# EAGLE design Qwiic_Shield_for_Teensy_Long (EAGLE 9.6.2)
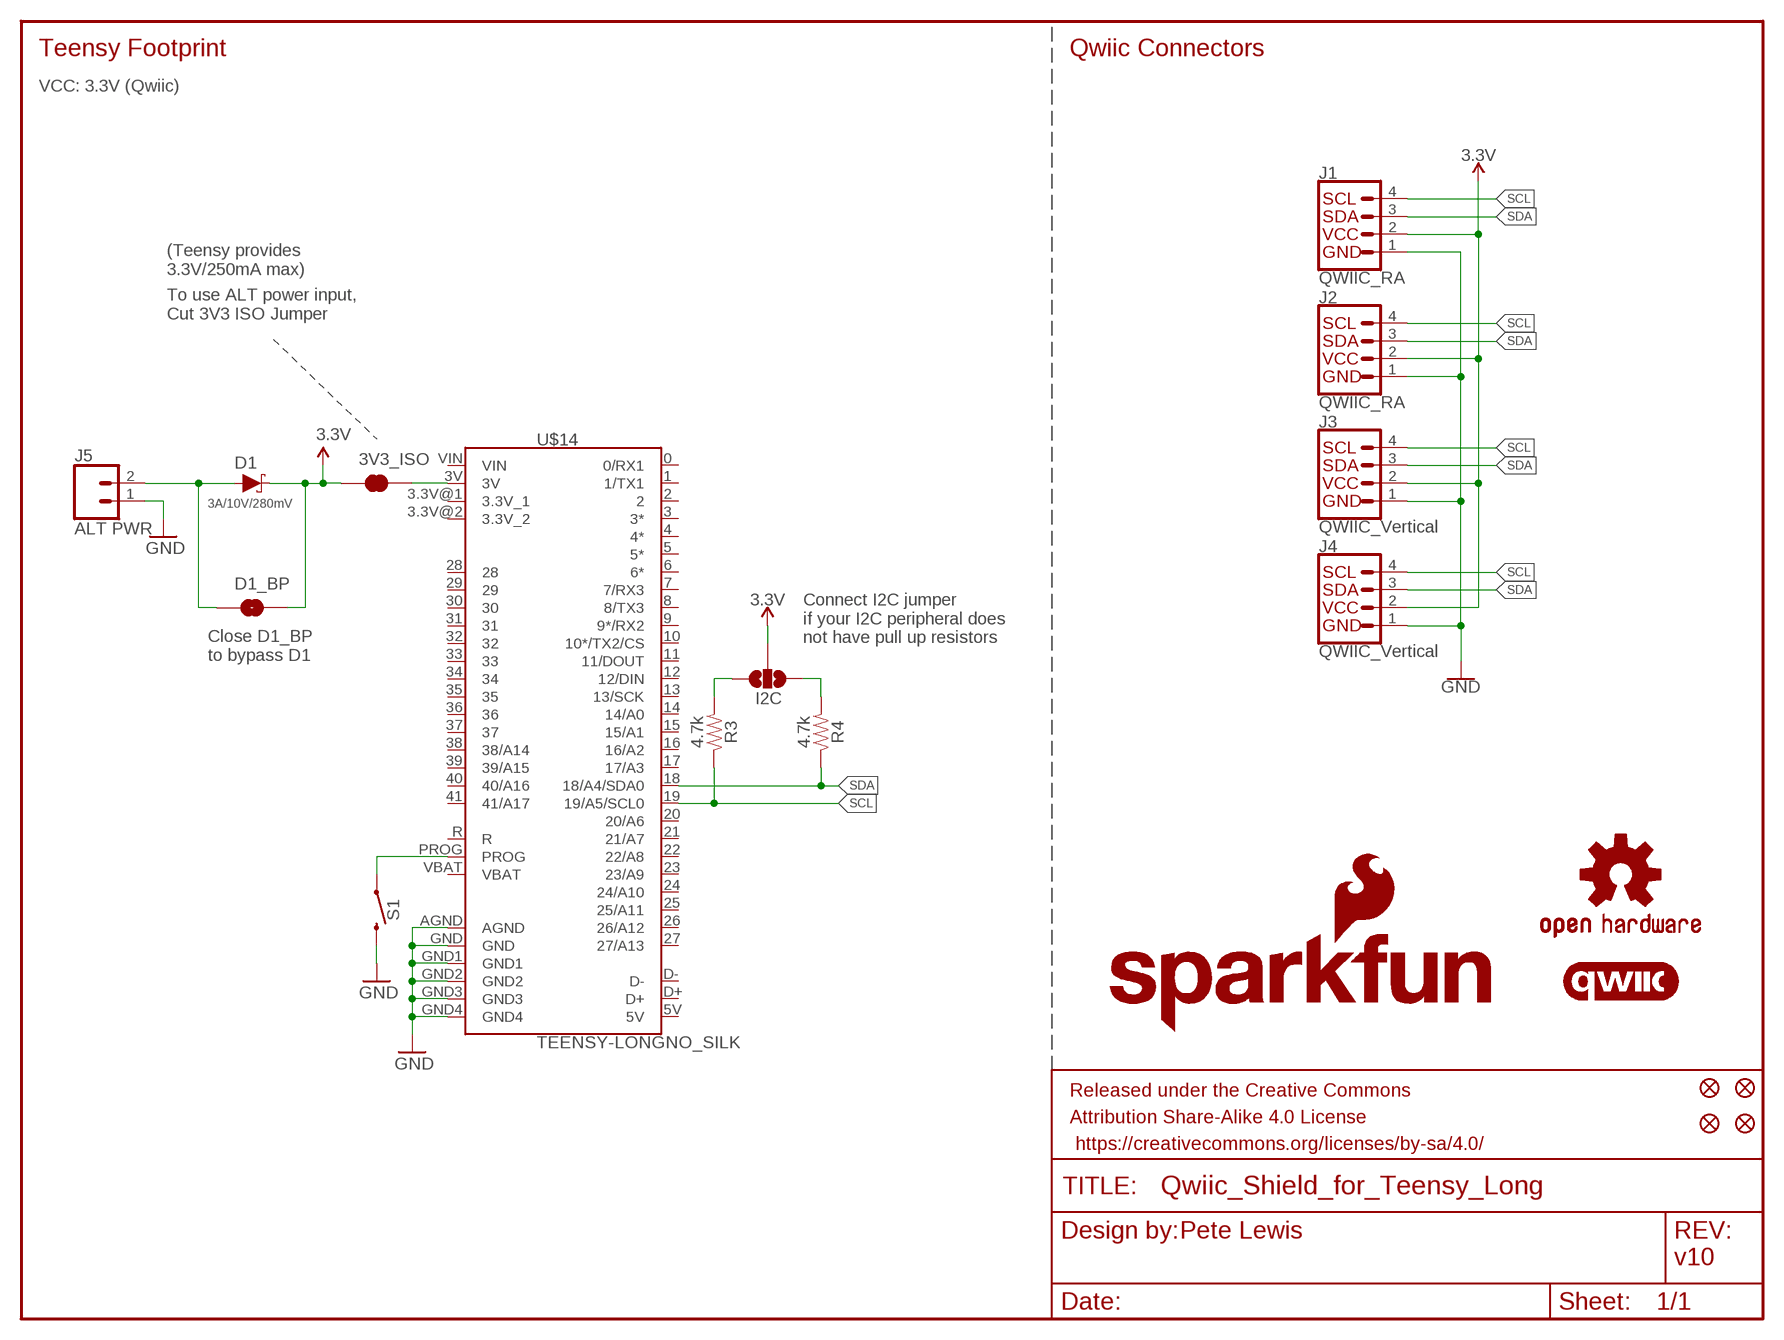
[diagram p0: schematic, sheet 1]

## Parts
3V3_ISO  JUMPER-SMT_2_NC_TRACE_SILK  [SMT-JUMPER_2_NC_TRACE_SILK]
D1  3A/10V/280mV  DIODE-SCHOTTKY-BAT60A  [SOD-323]
D1_BP  JUMPER-SMT_2_NO_SILK  [SMT-JUMPER_2_NO_SILK]
FD1  FIDUCIAL1X2  [FIDUCIAL-1X2]
FD2  FIDUCIAL1X2  [FIDUCIAL-1X2]
FD3  FIDUCIAL1X2  [FIDUCIAL-1X2]
FD4  FIDUCIAL1X2  [FIDUCIAL-1X2]
FRAME1  FRAME-LETTER  [CREATIVE_COMMONS]
I2C  JUMPER-SMT_3_NO_SILK  [SMT-JUMPER_3_NO_SILK]
J1  QWIIC_RA  QWIIC_CONNECTORJS-1MM  [JST04_1MM_RA]
J2  QWIIC_RA  QWIIC_CONNECTORJS-1MM  [JST04_1MM_RA]
J3  QWIIC_Vertical  QWIIC_CONNECTOR  [JST04_1MM_VERT]
J4  QWIIC_Vertical  QWIIC_CONNECTOR  [JST04_1MM_VERT]
J5  ALT PWR  CONN_021X02_NO_SILK  [1X02_NO_SILK]
LOGO1  SFE_LOGO_NAME_FLAME.1_INCH  [SFE_LOGO_NAME_FLAME_.1]
LOGO2  SFE_LOGO_NAME_FLAME.1_INCH  [SFE_LOGO_NAME_FLAME_.1]
LOGO3  OSHW-LOGOS  [OSHW-LOGO-S]
LOGO4  QWIIC_LOGO_5MM  [QWIIC_5MM]
LOGO5  QWIIC_LOGO_5MM  [QWIIC_5MM]
R3  4.7k  4.7KOHM-0603-1/10W-1%  [0603]
R4  4.7k  4.7KOHM-0603-1/10W-1%  [0603]
S1  MOMENTARY-SWITCH-SPST-SMD-5.2MM-TALL  [TACTILE_SWITCH_SMD_5.2MM]
U$14  TEENSY-LONGNO_SILK  [TEENSY-LONG_NO_SILK]

## Nets
3.3V: 3V3_ISO.1 D1.C D1_BP.2 I2C.2 J1.2 J2.2 J3.2 J4.2
GND: J1.1 J2.1 J3.1 J4.1 J5.1 S1.3 U$14.AGND U$14.GND U$14.GND1 U$14.GND2 U$14.GND3 U$14.GND4
N$1: I2C.3 R4.2
N$2: I2C.1 R3.2
N$3: 3V3_ISO.2 U$14.3V
N$4: D1.A D1_BP.1 J5.2
N$5: S1.1 U$14.PROG
SCL: J1.4 J2.4 J3.4 J4.4 R3.1 U$14.19(19/A5/SCL0)
SDA: J1.3 J2.3 J3.3 J4.3 R4.1 U$14.18(18/A4/SDA0)
Unconnected: U$14.0(0/RX1) U$14.1(1/TX1) U$14.2 U$14.3(3*) U$14.4(4*) U$14.5(5*) U$14.6(6*) U$14.7(7/RX3) U$14.8(8/TX3) U$14.9(9*/RX2) U$14.10(10*/TX2/CS) U$14.11(11/DOUT) U$14.12(12/DIN) U$14.13(13/SCK) U$14.14(14/A0) U$14.15(15/A1) U$14.16(16/A2) U$14.17(17/A3) U$14.20(20/A6) U$14.21(21/A7) U$14.22(22/A8) U$14.23(23/A9) U$14.24(24/A10) U$14.25(25/A11) U$14.26(26/A12) U$14.27(27/A13) U$14.28 U$14.29 U$14.30 U$14.31 U$14.32 U$14.33 U$14.34 U$14.35 U$14.36 U$14.37 U$14.38(38/A14) U$14.39(39/A15) U$14.40(40/A16) U$14.41(41/A17) U$14.R

## Notes on the sheet
- Teensy Footprint | Qwiic Connectors
- VCC: 3.3V (Qwiic)
- (Teensy provides 
  3.3V/250mA max)
- To use ALT power input,
  Cut 3V3 ISO Jumper
- Connect I2C jumper 
  if your I2C peripheral does 
  not have pull up resistors
- Close D1_BP
  to bypass D1
- Pete Lewis
- v10

## Power pins joined to a net without a drawn wire
3.3V_1: U$14.3.3V@1(3.3V_1)
3.3V_2: U$14.3.3V@2(3.3V_2)
5V: U$14.5V
D+: U$14.D+
D-: U$14.D-
VBAT: U$14.VBAT
VIN: U$14.VIN

## Library data of the parts
3V3_ISO = SparkFun-Jumpers:JUMPER-SMT_2_NC_TRACE: Normally closed trace jumper This jumper has a trace between two pads so it's normally closed (NC). Use a razor knife to open the connection. For best results follow the IPC guidelines for cutting traces: Cutout at least 0.063 mm (0.005 in). Remove all loose material to clean up the cut area. Seal the cut with an approved epoxy. Reapply solder to reclose the connection.
D1 = SparkFun-DiscreteSemi:DIODE-SCHOTTKY: Schottky diode A Schottky diode is a semiconductor diode which has a low forward voltage drop and a very fast switching action.; PROD_ID: DIO-14072
D1_BP = SparkFun-Jumpers:JUMPER-SMT_2_NO: Normally open jumper This jumper has two pads in close proximity to each other. Apply solder to close the connection. Round pads are easier to solder for beginners, but are a lot larger. SparkFun Product that uses the round pads: SparkFun EL Sequencer <https://www.sparkfun.com/products/12781>
FD1-FD4 = SparkFun-Aesthetics:FIDUCIAL: Fiducial Alignment Points Point-of-reference for pick-and-place machines and other optical instruments.
FRAME1 = SparkFun-Aesthetics:FRAME-LETTER: Schematic Frame - Letter Standard 8.5x11 US Letter frame
I2C = SparkFun-Jumpers:JUMPER-SMT_3_NO: Normally open jumper This jumper has three pads in close proximity to each other. Apply solder to close the connection(s).
J1 J2 = SparkFun-Connectors:QWIIC_CONNECTOR: SparkFun I2C Standard Qwiic Connector An SMD 1mm pitch JST connector makes it easy and quick (get it? Qwiic?) to connect I2C devices to each other. The Qwiic system <http://www.sparkfun.com/qwiic> enables fast and solderless connection between popular platforms and various sensors and actuators. We carry 200mm <https://www.sparkfun.com/products/14204>, 100mm <https://www.sparkfun.com/products/14205>, 50mm <https://www.sparkfun.com/products/14206>, and breadboard friendly <https://www.sparkfun.com/products/14207> Qwiic cables. We also offer 10 pcs strips <https://www.sparkfun.com/products/14323> the SMD connectors.; PROD_ID: CONN-13694; VALUE: QWIIC_RIGHT_ANGLE
J3 J4 = SparkFun-Connectors:QWIIC_CONNECTOR: SparkFun I2C Standard Qwiic Connector An SMD 1mm pitch JST connector makes it easy and quick (get it? Qwiic?) to connect I2C devices to each other. The Qwiic system <http://www.sparkfun.com/qwiic> enables fast and solderless connection between popular platforms and various sensors and actuators. We carry 200mm <https://www.sparkfun.com/products/14204>, 100mm <https://www.sparkfun.com/products/14205>, 50mm <https://www.sparkfun.com/products/14206>, and breadboard friendly <https://www.sparkfun.com/products/14207> Qwiic cables. We also offer 10 pcs strips <https://www.sparkfun.com/products/14323> the SMD connectors.; PROD_ID: CONN-14483; VALUE: Vertical Qwiic Connector
J5 = SparkFun-Connectors:CONN_02: Multi connection point. Often used as Generic Header-pin footprint for 0.1 inch spaced/style header connections On any of the 0.1 inch spaced packages, you can populate with these: Break Away Headers - Straight <https://www.sparkfun.com/products/116> (PRT-00116) Break Away Male Headers - Right Angle <https://www.sparkfun.com/products/553> (PRT-00553) Female Headers <https://www.sparkfun.com/products/115> (PRT-00115) Break Away Headers - Machine Pin <https://www.sparkfun.com/products/117> (PRT-00117) Break Away Female Headers - Swiss Machine Pin <https://www.sparkfun.com/products/743> (PRT-00743) For SCREWTERMINALS and SPRING TERMINALS visit here: Screw Terimnals on SparkFun.com <https://www.sparkfun.com/search/results?term=Screw+Terminals> (5mm/3.5mm/2.54mm spacing) This device is also useful as a general connection point to wire up your design to another part of your project. Our various solder wires solder well into these plated through hole pads. Hook-Up Wire - Assortment (Stranded, 22 AWG) <https://www.sparkfun.com/products/11375> (PRT-11375) Hook-Up Wire - Assortment (Solid Core, 22 AWG) <https://www.sparkfun.com/products/11367> (PRT-11367) View the entire wire category on our website here <https://www.sparkfun.com/categories/141> Special notes: Molex polarized connector foot print use with: PRT-08233 with associated crimp pins and housings. 2.54_SCREWTERM for use with PRT-10571. 3.5mm Screw Terminal footprints for PRT-08084 5mm Screw Terminal footprints for use with PRT-08432
LOGO1 LOGO2 = SparkFun-Aesthetics:SFE_LOGO_NAME_FLAME: SparkFun Font Logo w/ Flame This is the SparkFun full logo. The logo on the schematic will always be the same size; the package variant is the height of the flame part of the logo. Default layer for the logo on the board is tSilk.
LOGO3 = SparkFun-Aesthetics:OSHW-LOGO: Open-Source Hardware (OSHW) Logo This logo indicates the piece of hardware it is found on incorporates a OSHW license and/or adheres to the definition of open source hardware found here: http://freedomdefined.org/OSHW
LOGO4 LOGO5 = SparkFun-Aesthetics:QWIIC_LOGO: Qwiic Logos for placement on schematic and PCB. The 5.5mm silk logo is best for placing next to Qwiic connector.
R3 R4 = SparkFun-Resistors:4.7KOHM: 4.7kΩ resistor A resistor is a passive two-terminal electrical component that implements electrical resistance as a circuit element. Resistors act to reduce current flow, and, at the same time, act to lower voltage levels within circuits. - Wikipedia; PROD_ID: RES-07857
S1 = SparkFun-Switches:MOMENTARY-SWITCH-SPST: Momentary Switch (Pushbutton) - SPST Normally-open (NO) SPST momentary switches (buttons, pushbuttons). Variants PTH-12MM - 12mm square, through-hole Momentary Pushbutton Switch - 12mm Square <https://www.sparkfun.com/products/9190> (COM-09190) PTH-6.0MM, PTH-6.0MM-KIT - 6.0mm square, through-hole Mini Pushbutton Switch <https://www.sparkfun.com/products/97> (COM-00097) KIT package intended for soldering kit's - only one side of pads' copper is exposed. PTH-RIGHT-ANGLE-KIT - Right-angle, through-hole Right Angle Tactile Button <https://www.sparkfun.com/products/10791> - Used on SparkFun BigTime Watch Kit <https://www.sparkfun.com/products/11734> SMD-12MM - 12mm square, surface-mount Tactile Button - SMD (12mm) <https://www.sparkfun.com/products/12993> (COM-12993) Used on SparkFun PicoBoard <https://www.sparkfun.com/products/11888> SMD-4.5MM - 4.5mm Square Trackball Switch Used on SparkFun Blackberry Trackballer Breakout <https://www.sparkfun.com/products/13169> SMD-4.6MMX2.8MM - 4.60mm x 2.80mm, surface mount Used on SparkFun SAMD21 Mini Breakout <https://www.sparkfun.com/products/13664> SMD-5.2MM, SMD-5.2-REDUNDANT - 5.2mm square, surface-mount Mini Pushbutton Switch - SMD <https://www.sparkfun.com/products/8720> (COM-08720) Used on Arduino Pro Mini <https://www.sparkfun.com/products/11114> REDUNDANT package connects both switch circuits together SMD-6.0X3.5MM - 6.0 x 3.5mm, surface mount Momentary Reset Switch SMD <https://www.sparkfun.com/products/8229> (COM-08229) SMD-6.2MM-TALL - 6.2mm square, surface mount Tactile Button - SMD (6mm) <https://www.sparkfun.com/products/12992> Used on SparkFun Digital Sandbox <https://www.sparkfun.com/products/12651> SMD-RIGHT-ANGLE - Right-angle, surface mount Used on SparkFun Block for Intel® Edison - Arduino <https://www.sparkfun.com/products/13036>; PROD_ID: SWCH-14139
U$14 = teensy_boards:TEENSY-LONG

## Board
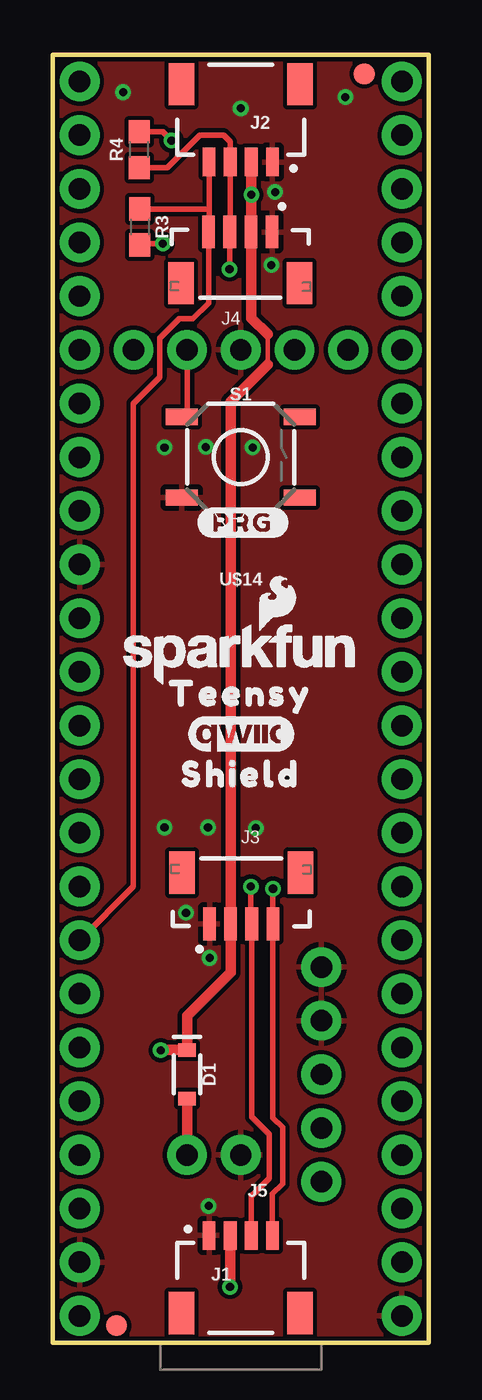
[diagram p1: board, top side]
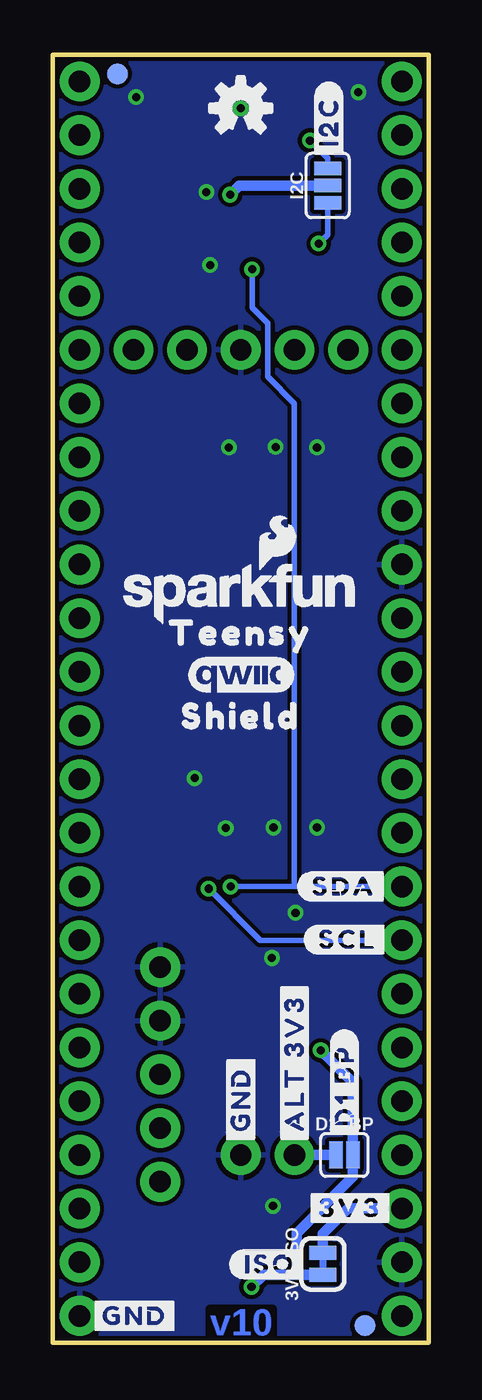
[diagram p2: board, bottom side, seen from below]

Size 17.78 x 60.96 mm. Coordinates in mm from the lower left corner, seen from the top.
Outline: 0,0 17.78,0 17.78,60.96 0,60.96 0,0
Copper layers (1*16): Top 0.035mm / dielectric 1.5mm / Bottom 0.035mm
Design rules "SparkFun-2-layer-TIGHT": minimum track width 7mil, minimum drill 15mil, track to track 7mil, track to pad 7mil, pad to pad 7mil, via to via 7mil, smd to smd 7mil, copper to edge 7mil, drill to drill 7mil, minimum pad ring 7mil, minimum via ring 7mil, stop-mask expansion 4mil, vias tented up to drill 25mil, thermal gap 10mil

### Footprints (pad centres in the part's own frame; a part is rotated, then mirrored left to right if it is on the bottom)
SMT-JUMPER_2_NC_TRACE_SILK = smd 0.66 x 1.27: 1 -0.521,0; 2 0.521,0
SOD-323 = smd 0.63 x 0.83: A 1.15,0; C -1.15,0
SMT-JUMPER_2_NO_SILK = smd 0.635 x 1.27: 1 -0.406,0; 2 0.406,0
FIDUCIAL-1X2 = smd 1 x 1: 1 0,0
SMT-JUMPER_3_NO_SILK = smd 0.635 x 1.27: 1 -0.813,0; 2 0,0; 3 0.813,0
JST04_1MM_RA = smd 0.6 x 1.35: 1 -1.5,0; 2 -0.5,0; 3 0.5,0; 4 1.5,0 | smd 1.2 x 2: NC1 2.8,-3.675; NC2 -2.8,-3.675
JST04_1MM_VERT = smd 0.6 x 1.55: 1 -1.478,0.775; 2 -0.478,0.775; 3 0.522,0.775; 4 1.522,0.775 | smd 1.2 x 2: NC1 -2.778,3.2; NC2 2.822,3.2
1X02_NO_SILK = drill 1.016 pad 1.88: 1 0,0; 2 2.54,0
0603 = smd 1.1 x 1: 1 -0.85,0; 2 0.85,0
TACTILE_SWITCH_SMD_5.2MM = smd 1.524 x 0.762: 1 -2.794,1.905; 2 2.794,1.905; 3 -2.794,-1.905; 4 2.794,-1.905
TEENSY-LONG_NO_SILK = drill 1.016 pad 1.88: 0 7.62,-13.97; 1 7.62,-11.43; 2 7.62,-8.89; 3 7.62,-6.35; 3.3V@1 7.62,19.05; 3.3V@2 2.54,29.21; 3V -7.62,-11.43; 4 7.62,-3.81; 5 7.62,-1.27; 5V 3.81,-10.16; 6 7.62,1.27; 7 7.62,3.81; 8 7.62,6.35; 9 7.62,8.89; 10 7.62,11.43; 11 7.62,13.97; 12 7.62,16.51; 13 -7.62,16.51; 14 -7.62,13.97; 15 -7.62,11.43; 16 -7.62,8.89; 17 -7.62,6.35; 18 -7.62,3.81; 19 -7.62,1.27; 20 -7.62,-1.27; 21 -7.62,-3.81; 22 -7.62,-6.35; 23 -7.62,-8.89; 24 7.62,21.59; 25 7.62,24.13; 26 7.62,26.67; 27 7.62,29.21; 28 7.62,31.75; 29 7.62,34.29; 30 7.62,36.83; 31 7.62,39.37; 32 7.62,41.91; 33 -7.62,41.91; 34 -7.62,39.37; 35 -7.62,36.83; 36 -7.62,34.29; 37 -7.62,31.75; 38 -7.62,29.21; 39 -7.62,26.67; 40 -7.62,24.13; 41 -7.62,21.59; AGND -7.62,-13.97; D+ 3.81,-5.08; D- 3.81,-7.62; GND 0,29.21; GND1 7.62,-16.51; GND2 -7.62,19.05; GND3 3.81,-2.54; GND4 3.81,0; PROG -2.54,29.21; R -5.08,29.21; VBAT 5.08,29.21; VIN -7.62,-16.51

### Placement (x,y rotation side)
3V3_ISO  5,3.73 90 bottom
D1  6.35,12.7 270 top
D1_BP  3.99,8.89 0 bottom
FD1  3.02,0.81 0 top
FD2  3.02,0.81 0 bottom
FD3  14.73,60.05 0 top
FD4  14.73,60.05 0 bottom
FRAME1  -12.7,-12.7 0 top  (outside the outline)
I2C  4.78,54.76 90 bottom
J1  8.89,5.08 0 top
J2  8.89,55.88 180 top
J3  8.89,19.05 0 top
J4  8.89,53.34 180 top
J5  8.89,8.89 180 top
LOGO1  8.89,35.46 0 bottom
LOGO2  8.89,32.59 0 top
LOGO3  8.89,58.42 0 bottom
LOGO4  8.89,28.83 0 top
LOGO5  8.89,31.62 0 bottom
R3  4.11,52.81 270 top
R4  4.09,56.46 90 top
S1  8.89,41.91 0 top
U$1  [#I2C#0]  4.72,55.91 90 bottom
U$2  [TEENSY0]  8.89,33.6 0 bottom
U$3  [3V36]  0,0 0 top
U$4  [#D1_BP#0]  3.99,9.53 90 bottom
U$5  [#ALT_3V3#0]  6.35,13.23 90 bottom
U$6  [#PRG#0]  8.99,38.81 0 top
U$7  [#GND#0]  8.89,11.51 90 bottom
U$8  [SHIELD0]  8.89,26.9 0 top
U$9  [#GND#0]  13.92,1.27 0 bottom
U$10  [#ISO#0]  7.52,3.71 0 bottom
U$12  [SHIELD0]  8.89,29.64 0 bottom
U$13  [TEENSY0]  8.89,30.73 0 top
U$14  8.89,17.78 0 top
U$15  [#3V3#0]  5.92,6.38 0 bottom
U$18  [#SDA#0]  1.78,21.59 0 bottom
U$19  [#SCL#0]  1.75,19.08 0 bottom

### Tracks (layer width: path | path; a pad name or v marks a point on that pad's centre or on a via)
3.3V  (via drill 0.38)
  Top 0.203: 10.16,46.28 10.16,47.73
  Top 0.508: J2.2 v9.39,54.33 9.39,52.59 | 9.39,52.59 J4.2 | v5.11,13.84 v5.11,13.85 D1.C 6.35,15.47 8.41,17.53 J3.2 8.41,44.53 10.16,46.28 | 9.39,52.59 9.39,48.5 10.16,47.73 | J1.2 v8.39,2.65 v8.38,2.64
  Bottom 0.508: 3V3_ISO.1 6.25,3.21 | 6.25,3.21 7.81,3.21 v8.38,2.64 | 6.25,3.21 6.25,5.18 3.58,7.85 D1_BP.2 3.58,12.32 v5.11,13.84 | I2C.2 8.96,54.76 v9.39,54.33
GND  (via drill 0.38)
  other vias: 7.37,6.48 7.42,18.21 10.34,51 10.52,54.46 6.3,20.35 11.07,26.72 7.34,24.38 5.28,24.38 9.6,24.36 5.28,42.37 7.24,42.39 9.45,42.37 13.84,58.95 8.89,58.42 3.33,59.18
  pour Top (isolate 0.203): 0,0 17.78,0 17.78,60.96 0,60.96
  pour Bottom (isolate 0.203): 17.78,0 0,0 0,60.96 17.78,60.96
N$1  (via drill 0.38)
  Top 0.254: v5.61,56.9 5.2,57.31 R4.2
  Bottom 0.254: I2C.3 4.78,56.06 v5.61,56.9
N$2  (via drill 0.38)
  Top 0.254: v5.21,52.02 4.18,52.02 R3.2
  Bottom 0.254: I2C.1 4.78,52.45 v5.21,52.02
N$3
  Bottom 0.508: 3V3_ISO.2 5,5.16 3.81,6.35 U$14.3V
N$4
  Top 0.508: J5.2 D1.A
  Bottom 0.508: J5.2 D1_BP.1
N$5
  Top 0.254: U$14.PROG 6.35,44.07 S1.1
SCL  (via drill 0.38)
  Top 0.254: J2.4 7.39,53.65 | 7.39,53.65 7.39,52.59 J4.4 7.37,49.2 6.63,48.46 5.97,48.46 5.05,47.55 5.05,45.7 3.81,44.45 3.81,21.59 U$14.19 | R3.1 7.38,53.66 7.39,53.65 | J1.4 10.39,7.04 10.87,7.52 10.87,10.19 10.41,10.64 J3.4 v10.41,21.49
  Bottom 0.254: U$14.19 7.98,19.05 v10.41,21.49
SDA  (via drill 0.38)
  Top 0.254: R4.1 5.42,55.61 6.96,57.15 8.08,57.15 8.39,56.84 J2.3 8.39,52.59 J4.3 v8.37,50.81 v8.36,50.8 | J1.3 9.39,6.93 10.24,7.77 10.24,9.86 9.41,10.68 J3.3 9.37,19.86 v9.37,21.59
  Bottom 0.254: U$14.18 6.35,21.59 | 6.35,21.59 v9.37,21.59 | v8.36,50.8 8.36,49 7.62,48.26 7.62,45.72 6.35,44.45 6.35,21.59

### Text on the board
Bottom: v10
tDocu: Pete Lewis